# EasyEDA Pro project 导入eda专业版即可.epro

# Schematic 电路管理_2
Create Date: 2024-08-25; Page Name: P1; Project Name: 2.4g发送端电路图; Schematic Name: 睫毛哥电路管理_2; Update Date: 2024-08-25; Company: 嘉立创EDA; Page Size: A4; Version: V1.0
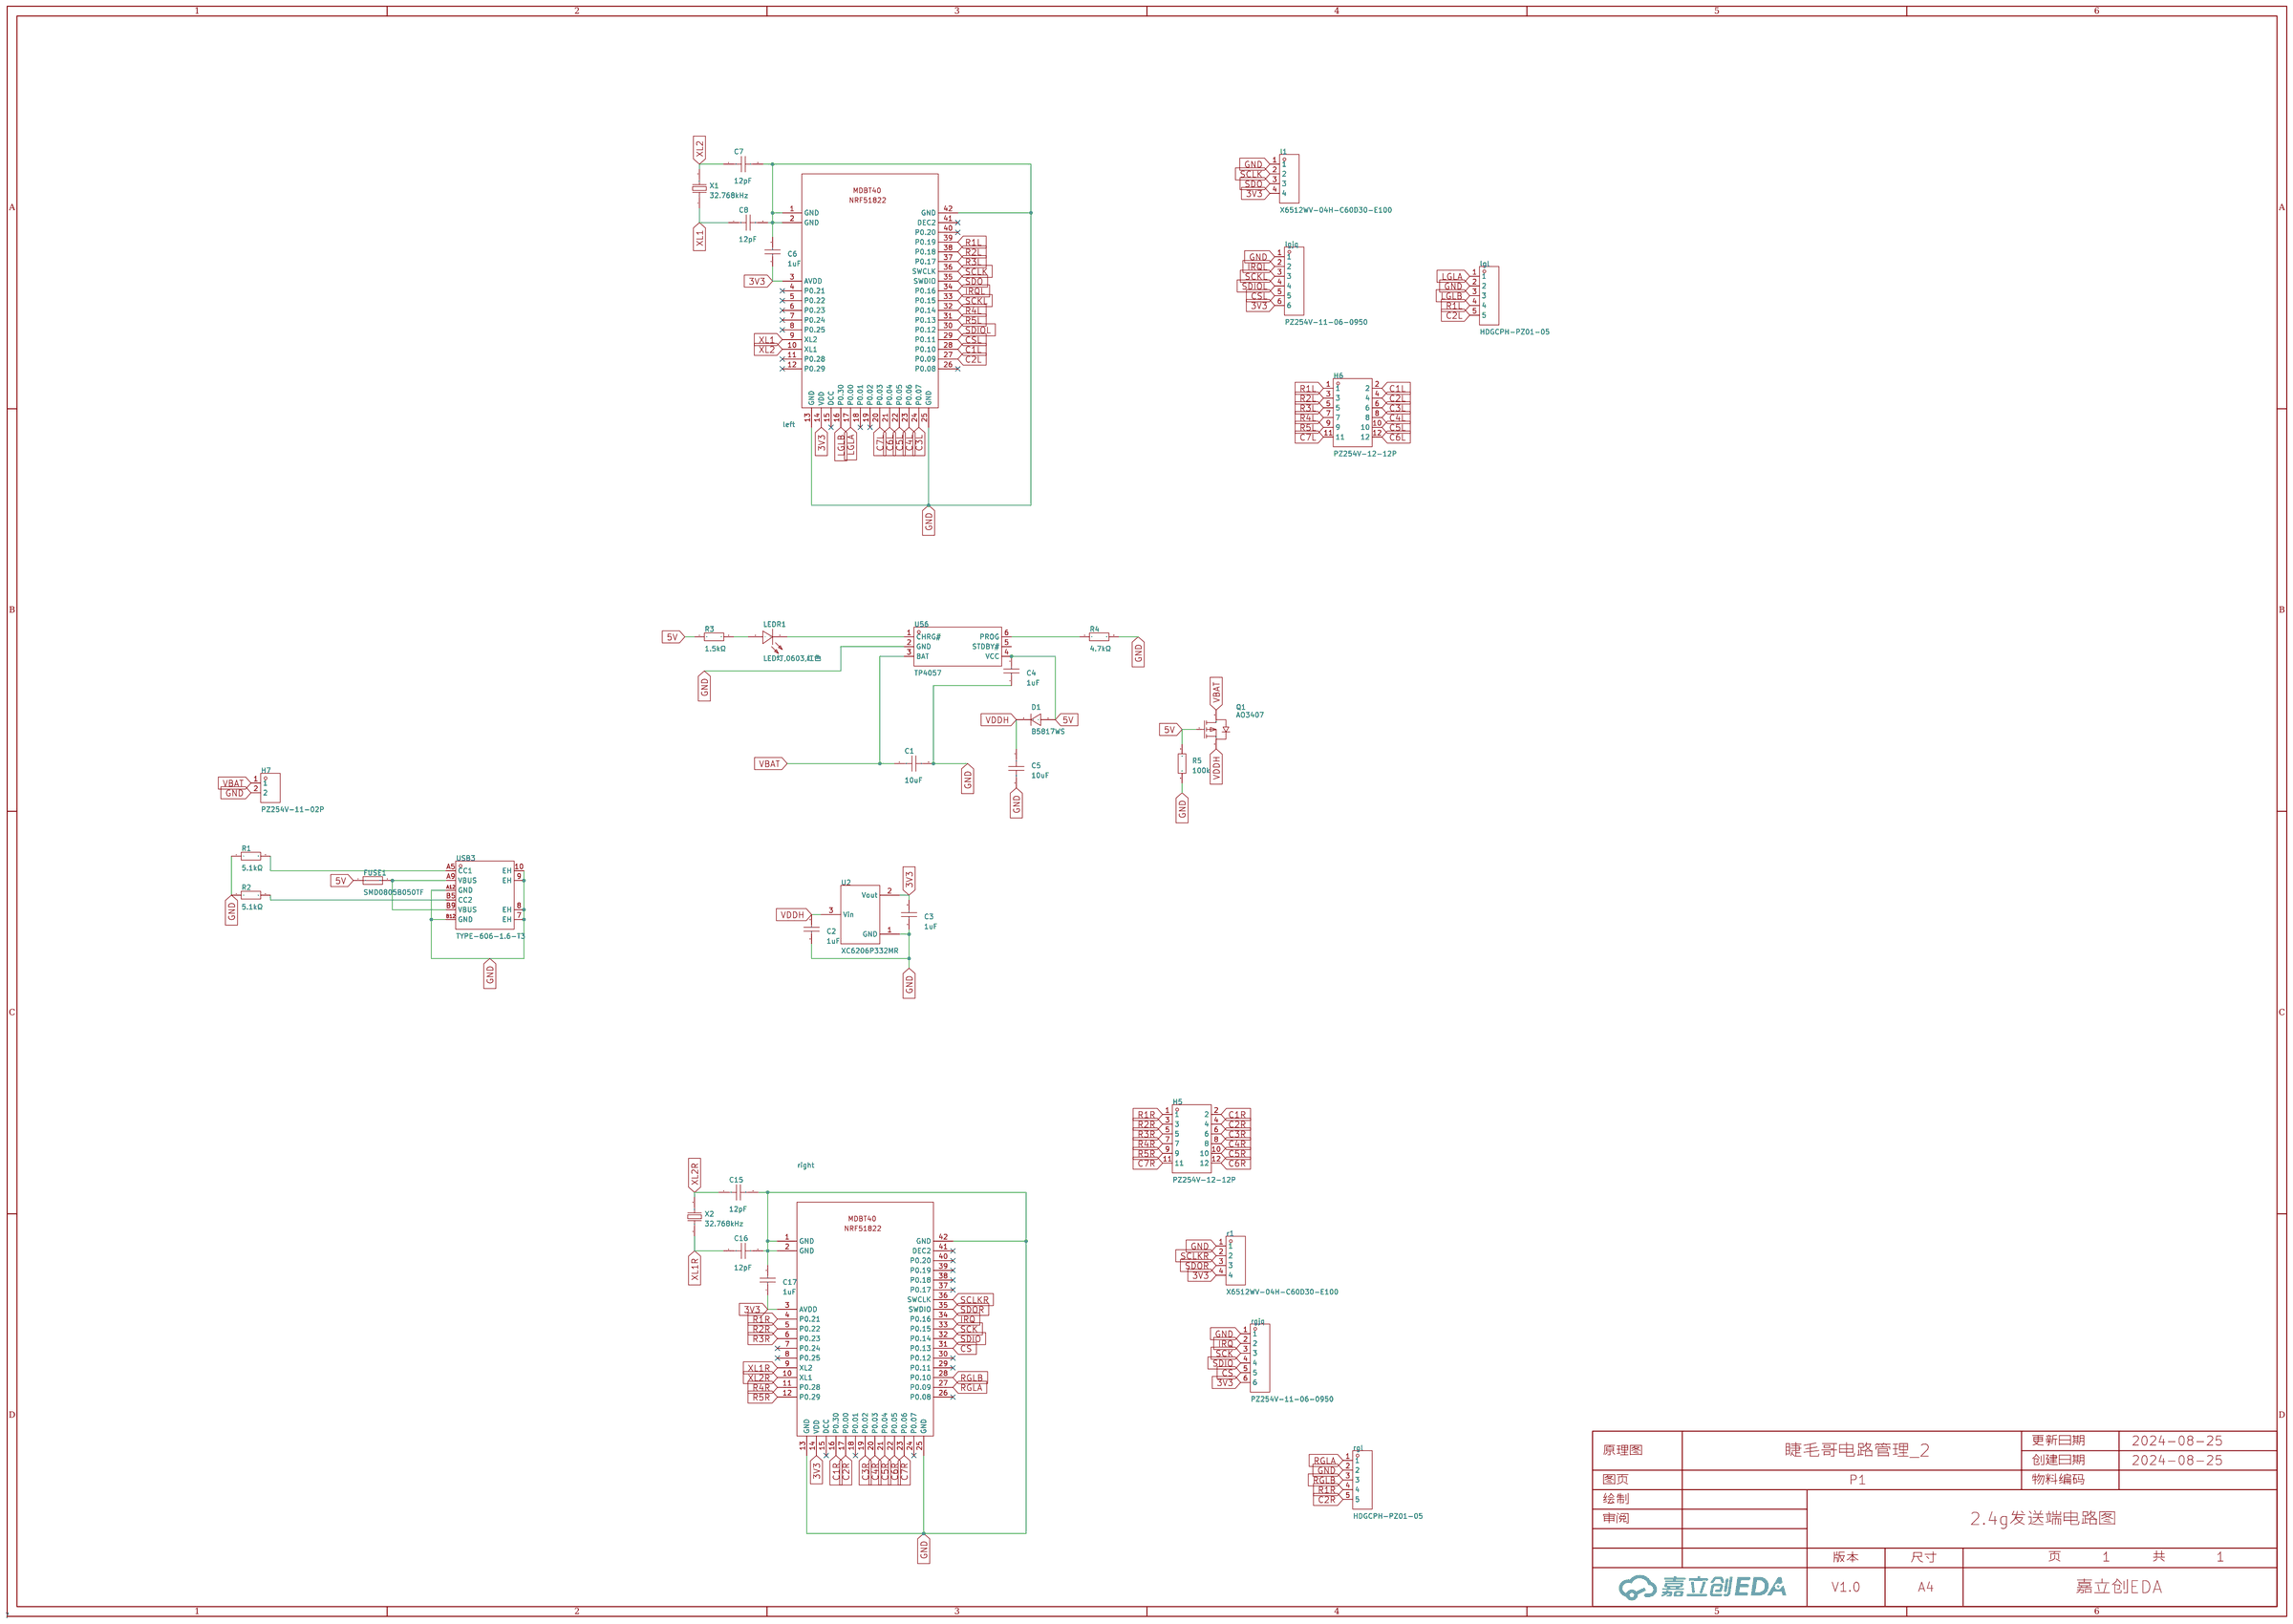
[diagram p0: schematic sheet]

## Parts
C1  10uF  [C0603]
C2  1uF  [C0603]
C3  1uF  [C0603]
C4  1uF  [C0603]
C5  10uF  [C0603]
C6  1uF  [C0603]
C7  12pF  [C0603]
C8  12pF  [C0603]
C15  12pF  [C0603]
C16  12pF  [C0603]
C17  1uF  [C0603]
D1  B5817WS  [SOD-323_L1.7-W1.3-LS2.7-FD]
FUSE1  SMD0805B050TF  [F0805]
H5  PZ254V-12-12P  [HDR-TH_12P-P2.54-V-M-R2-C6-S2.54]
H6  PZ254V-12-12P  [HDR-TH_12P-P2.54-V-M-R2-C6-S2.54]
H7  PZ254V-11-02P  [HDR-TH_2P-P2.54-V-M]
l1  X6512WV-04H-C60D30-E100  [HDR-TH_4P-P2.54-V-M-1]
LEDR1  LED灯,0603,红色  [LED0603-RD_RED]
left  -  [MDBT40]
lgjq  PZ254V-11-06-0950  [HDR-TH_6P-P2.54-V-M-1]
lgl  HDGCPH-PZ01-05  [HDR-TH_5P-P2.54-V-M-1]
Q1  AO3407  [SOT-23-3_L2.9-W1.6-P1.90-LS2.8-BR]
R1  5.1kΩ  [R0603]
r1  X6512WV-04H-C60D30-E100  [HDR-TH_4P-P2.54-V-M-1]
R2  5.1kΩ  [R0603]
R3  1.5kΩ  [R0603]
R4  4.7kΩ  [R0603]
R5  100k  [R0603]
rgjq  PZ254V-11-06-0950  [HDR-TH_6P-P2.54-V-M-1]
rgl  HDGCPH-PZ01-05  [HDR-TH_5P-P2.54-V-M-1]
right  -  [MDBT40]
U2  XC6206P332MR  [SOT-23-3_L2.9-W1.6-P1.90-LS2.8-BR]
U56  TP4057  [SOT-23-6_L2.9-W1.6-P0.95-LS2.8-BR]
USB3  TYPE-606-1.6-T3  [USB-C-SMD_TYPE-606-1.6-T3]
X1  32.768kHz  [FC-135R_L3.2-W1.5]
X2  32.768kHz  [FC-135R_L3.2-W1.5]

## Library data of the parts
C1 C5 = CL10A106KP8NNNC: 容值:10uF;精度:±10%;额定电压:10V;材质(温度系数):X5R;; LCSC Part Name: 10uF ±10% 10V; Supplier Part: C19702; Manufacturer: SAMSUNG(三星); Supplier Footprint: 0603; Datasheet: https://atta.szlcsc.com/upload/public/pdf/source/20160218/1457707763339.pdf; Supplier: LCSC; Tolerance: ±10%; Voltage Rated: 10V; Temperature Coefficient: X5R
C2-C4 C6 C17 = CL10A105KB8NNNC: 容值:1uF;精度:±10%;额定电压:50V;材质(温度系数):X5R;; LCSC Part Name: 1uF ±10% 50V; Supplier Part: C15849; Manufacturer: SAMSUNG(三星); Supplier Footprint: 0603; JLCPCB Part Class: 基础库; Datasheet: https://atta.szlcsc.com/upload/public/pdf/source/20160103/1457707679084.pdf; Supplier: LCSC; Tolerance: ±10%; Voltage Rated: 50V; Temperature Coefficient: X5R
C7 C8 C15 C16 = 0603Y0160120KFR: 容值:12pF;精度:±10%;额定电压:16V;材质(温度系数):-;; LCSC Part Name: 12pF ±10% 16V; Supplier Part: C2313740; Manufacturer: Knowles(楼氏); Supplier Footprint: 0603; JLCPCB Part Class: 扩展库; Supplier: LCSC; Tolerance: ±10%; Voltage Rated: 16V
D1 = B5817WS: 正向压降(Vf):750mV@3A;直流反向耐压(Vr):20V;平均整流电流(Io):1A;; LCSC Part Name: 电压:20V 电流:1A; Supplier Part: C511871; Manufacturer: BORN(伯恩半导体); Supplier Footprint: SOD-323; JLCPCB Part Class: 扩展库; Datasheet: https://atta.szlcsc.com/upload/public/pdf/source/20200413/C511871_84C991E4F87F9BC6B00A967897FF2061.pdf; Supplier: LCSC; Forward Voltage (Vf@If): 750mV@3A; Reverse Voltage (Vr): 20V; Average Rectified Current (Io): 1A
FUSE1 = SMD0805B050TF: 最大电压:6V;最大电流:100A;保持电流:500mA;跳闸电流:1A;; LCSC Part Name: 6V 500mA 0805自恢复; Supplier Part: C269104; Manufacturer: Brightking(君耀电子); Supplier Footprint: 0805; Datasheet: https://atta.szlcsc.com/upload/public/pdf/source/20180814/C269104_466839A5DB65F6E723CA6A162ACE747B.pdf; Supplier: LCSC; Operating Voltage (Max): 6V; Current Rating (Max): 100A; Hold Current: 500mA; Trip Current: 1A; Maximum Time to Trip: 100ms
H5 H6 = PZ254V-12-12P: 插针结构:2x6P;间距:2.54mm;行距:2.54mm;圆针/方针:方针;安装类型:直插;排数:双排;总PIN位数:12P;额定电流:-;额定电压:-;配合针长度:6mm;塑高:2.5mm;端接针长度:3mm;触头材质:黄铜;触头镀层:-;工作温度范围:-40℃~+105℃;颜色:黑色;; LCSC Part Name: 间距:2.54mm 2x6P 直插 方针; Supplier Part: C492423; Manufacturer: XFCN(兴飞); Supplier Footprint: 插件,P=2.54mm; Datasheet: https://atta.szlcsc.com/upload/public/pdf/source/20200309/C492423_E4E2C9BC0EB9D59A2ABE4377D2E234B2.pdf; Supplier: LCSC; Pin Structure: 2x6P; Pitch: 2.54mm; Row Spacing: 2.54mm; Circluar Pins/Square Pins: 方针; Mounting Type: 直插; Number of Rows: 双排; Number of Pins: 12P; Length of Mating Pin: 6mm; Insulation Height: 2.5mm; Length of End Connection Pin: 3mm; Contact Material: 黄铜; Operating Temperature Range: -40℃~+105℃; Color: 黑色
H7 = PZ254V-11-02P: 插针结构:1x2P;间距:2.54mm;行距:-;圆针/方针:方针;安装类型:直插;排数:单排;总PIN位数:2P;额定电流:-;额定电压:-;配合针长度:6mm;塑高:2.5mm;端接针长度:3mm;触头材质:黄铜;触头镀层:-;工作温度范围:-40℃~+105℃;颜色:黑色;; LCSC Part Name: 间距:2.54mm 1x2P 直插 方针; Supplier Part: C492401; Manufacturer: XFCN(兴飞); Supplier Footprint: 插件,P=2.54mm; Datasheet: https://atta.szlcsc.com/upload/public/pdf/source/20200309/C492401_A812433581A9B211A7FFA413ADDFF0E5.pdf; Supplier: LCSC; Pin Structure: 1x2P; Pitch: 2.54mm; Circluar Pins/Square Pins: 方针; Mounting Type: 直插; Number of Rows: 单排; Number of Pins: 2P; Length of Mating Pin: 6mm; Insulation Height: 2.5mm; Length of End Connection Pin: 3mm; Contact Material: 黄铜; Operating Temperature Range: -40℃~+105℃; Color: 黑色
l1 r1 = X6512WV-04H-C60D30-E100: 插针结构:1x4P;间距:2.54mm;行距:2.54mm;圆针/方针:方针;安装类型:-;排数:单排;总PIN位数:4P;额定电流:3A;额定电压:250V;配合针长度:6mm;塑高:2.5mm;端接针长度:3mm;触头材质:黄铜;触头镀层:金;工作温度范围:-40℃~+105℃;焊接温度(最大值):260℃;颜色:黑色;; LCSC Part Name: 1x4P 间距:2.54mm 方针; Supplier Part: C5242237; Manufacturer: XKB Connection(中国星坤); Supplier Footprint: 插件,P=2.54mm; Datasheet: https://atta.szlcsc.com/upload/public/pdf/source/20221103/F875B4EAB1B7CCE28A1CCAF56DA9899E.pdf; Supplier: LCSC; Pin Structure: 1x4P; Pitch: 2.54mm; Row Spacing: 2.54mm; Circluar Pins/Square Pins: 方针; Number of Rows: 单排; Number of Pins: 4P; Current Rating (Max): 3A; Voltage Rating (Max): 250V; Length of Mating Pin: 6mm; Insulation Height: 2.5mm; Length of End Connection Pin: 3mm; Contact Material: 黄铜; Contact Plating: 金; Operating Temperature Range: -40℃~+105℃; Soldering Temperature(Max): 260℃; Color: 黑色
LEDR1 = LED灯,0603,红色: Supplier Part: C9900011153; Supplier Footprint: 0603-LED红灯; JLCPCB Part Class: 扩展库; Datasheet: https://atta.szlcsc.comnull; Supplier: LCSC
left right = MDBT40
lgjq rgjq = PZ254V-11-06-0950: LCSC Part Name: 排针 间距2.54mm 1X6P 单排 直插 直针外露4mm; Supplier Part: C962330; Manufacturer: XFCN(兴飞); Supplier Footprint: 插件,P=2.54mm; Supplier: LCSC
lgl rgl = HDGCPH-PZ01-05: LCSC Part Name: 2.54单排针直插排针L11.6/3.0 1x5P; Supplier Part: C19190971; Manufacturer: HDGC(华德共创); Supplier Footprint: 插件,P=2.54mm; Datasheet: https://atta.szlcsc.com/upload/public/pdf/source/20231110/9EB16C2E1D607182756B4718BDE6A9C4.pdf; Supplier: LCSC
Q1 = AO3407: 类型:-;漏源电压(Vdss):-;连续漏极电流(Id):-;功率(Pd):-;导通电阻(RDS(on)@Vgs,Id):-;阈值电压(Vgs(th)@Id):-;; Supplier Part: C727158; Manufacturer: TWGMC(台湾迪嘉); Supplier Footprint: SOT-23; JLCPCB Part Class: 扩展库; Datasheet: https://atta.szlcsc.com/upload/public/pdf/source/20200827/C727158_282ADD6E8EE14B419EAB19F2812EAF45.pdf; Supplier: LCSC
R1 R2 = 0603WAF5101T5E: 电阻类型:厚膜电阻;阻值:5.1kΩ;精度:±1%;功率:100mW;; LCSC Part Name: 5.1kΩ ±1% 100mW; Supplier Part: C23186; Manufacturer: UNI-ROYAL(厚声); Supplier Footprint: 0603; JLCPCB Part Class: 基础库; Datasheet: https://atta.szlcsc.com/upload/public/pdf/source/20200306/C422600_1E6D84923E4A46A82E41ADD87F860B5C.pdf; Supplier: LCSC; Type: 厚膜电阻; Tolerance: ±1%; Power(Watts): 100mW; Temperature Coefficient: ±100ppm/℃; Overload Voltage (Max): 75V; Operating Temperature Range: -55℃~+155℃
R3 R5 = RS-03K102JT: 电阻类型:厚膜电阻;阻值:1kΩ;精度:±5%;功率:100mW;最大工作电压:50V;温度系数:±100ppm/℃;; LCSC Part Name: 1kΩ ±5% 100mW; Supplier Part: C73797; Manufacturer: FH(风华); Supplier Footprint: 0603; Datasheet: https://atta.szlcsc.com/upload/public/pdf/source/20140616/1457707091974.pdf; Supplier: LCSC; Type: 厚膜电阻; Tolerance: ±5%; Power(Watts): 100mW; Overload Voltage (Max): 50V; Temperature Coefficient: ±100ppm/℃; Operating Temperature Range: -55℃~+155℃
R4 = 0603WAF4701T5E: 阻值:4.7kΩ;精度:±1%;功率:100mW;温度系数:±100ppm/℃;电阻类型:厚膜电阻;; LCSC Part Name: 4.7kΩ ±1% 100mW 厚膜电阻; Supplier Part: C23162; Manufacturer: UNI-ROYAL(厚声); Supplier Footprint: 0603; Datasheet: https://atta.szlcsc.com/upload/public/pdf/source/20200306/C422600_1E6D84923E4A46A82E41ADD87F860B5C.pdf; Supplier: LCSC; Tolerance: ±1%; Power(Watts): 100mW; Overload Voltage (Max): 75V; Temperature Coefficient: ±100ppm/℃; Type: 厚膜电阻; Operating Temperature Range: -55℃~+155℃
U2 = XC6206P332MR_C5446: 输出类型:固定;输出极性:正;最大输入电压:6V;输出电压:3.3V;输出电流:200mA;电源纹波抑制比(PSRR):-;; Supplier Part: C5446; Manufacturer: TOREX(特瑞仕); Supplier Footprint: SOT-23-3L; JLCPCB Part Class: 基础库; Datasheet: https://atta.szlcsc.com/upload/public/pdf/source/20130801/1457706628791.pdf; Supplier: LCSC; Output Type: 固定; Output Polarity: 正; Number of Outputs: 1; Maximum Input Voltage: 6V; Output Voltage: 3.3V; Dropout Voltage: 680mV@(100mA); Output Current: 200mA
U56 = TP4057: 电源电压:6.5V;最大充电电流:500mA;电池类型:锂离子/聚合物;电池节数:1;; Supplier Part: C725791; Manufacturer: UMW(友台半导体); Supplier Footprint: SOT-23-6; Datasheet: https://atta.szlcsc.com/upload/public/pdf/source/20231109/7FB39B0490CD1514A6792371FCA0BB30.pdf; Supplier: LCSC; Supply Voltage: 6.5V; Maximum Charge Current: 500mA; Type of Battery: 锂离子/聚合物; Number of Cells: 1; Operating Temperature: -40℃~+85℃
USB3 = TYPE-606-1.6-T3: 连接器类型:Type-C;标准:-;公母:母;触点数量:6P;端口数量:1;安装方式:沉板;额定电流 - 电源:3A;工作温度范围:-25℃~+85℃;; LCSC Part Name: Type-C 母 沉板 沉板式1.6mm四脚母座端子镀金; Supplier Part: C2689842; Manufacturer: Yuandi(元迪); Supplier Footprint: SMD; Datasheet: https://atta.szlcsc.com/upload/public/pdf/source/20210201/C2689842_AEB1C5B3172DCF256BD26506C0F3DE02.pdf; Supplier: LCSC; Connector Type: Type-C; Gender: 母; Number of Contacts: 6P; Number of Ports: 1; Mounting Style: 沉板; Current Rating - Power (Max): 3A; Operating Temperature Range: -25℃~+85℃
X1 X2 = Q13FC1350000400: 频率:32.768kHz;频率公差:±20ppm;负载电容:12.5pF;; LCSC Part Name: 32.768kHz ±20ppm 12.5pF; Supplier Part: C32346; Manufacturer: EPSON(爱普生); Supplier Footprint: SMD3215-2P; JLCPCB Part Class: 基础库; Datasheet: https://atta.szlcsc.com/upload/public/pdf/source/20190108/C32346_746D6B07EAF90824457A96480007685F.pdf; Supplier: LCSC; Crystal Type: 贴片无源晶振; Frequency Tolerance: ±20ppm; Load Capacitance: 12.5pF; Equivalent Series Resistance (ESR): 70kΩ; Operating Temperature: -40℃~+85℃

## Nets
3V3: C3.2 C6.1 C17.1 l1.4 left.3(AVDD) left.14(VDD) lgjq.6 r1.4 rgjq.6 right.3(AVDD) right.14(VDD) U2.2(Vout)
5V: C4.2 D1.1(A) FUSE1.1 Q1.1(G) R3.1 R5.1 U56.4(VCC)
GND: C1.2 C2.1 C3.1 C4.1 C5.2 C6.2 C7.2 C8.2 C15.2 C16.2 C17.2 H7.2 l1.1 left.1(GND) left.2(GND) left.13(GND) left.25(GND) left.42(GND) lgjq.1 lgl.2 R1.1 r1.1 R2.1 R4.2 R5.2 rgjq.1 rgl.2 right.1(GND) right.2(GND) right.13(GND) right.25(GND) right.42(GND) U2.1(GND) U56.2(GND) USB3.7(EH) USB3.8(EH) USB3.9(EH) USB3.10(EH) USB3.A12(GND) USB3.B12(GND)
VBAT: C1.1 H7.1 Q1.3(D) U56.3(BAT)
VDDH: C2.2 C5.1 D1.2(K) Q1.2(S) U2.3(Vin)
C1L: H6.2 left.28(P0.10)
C1R: H5.2 right.16(P0.30)
C2L: H6.4 left.27(P0.09) lgl.5
C2R: H5.4 rgl.5 right.17(P0.00)
C3L: H6.6 left.24(P0.07)
C3R: H5.6 right.19(P0.02)
C4L: H6.8 left.23(P0.06)
C4R: H5.8 right.20(P0.03)
C5L: H6.10 left.22(P0.05)
C5R: H5.10 right.21(P0.04)
C6L: H6.12 left.21(P0.04)
C6R: H5.12 right.22(P0.05)
C7L: H6.11 left.20(P0.03)
C7R: H5.11 right.23(P0.06)
CS: rgjq.5 right.31(P0.13)
CSL: left.29(P0.11) lgjq.5
IRQ: rgjq.2 right.34(P0.16)
IRQL: left.34(P0.16) lgjq.2
LGLA: left.17(P0.00) lgl.1
LGLB: left.16(P0.30) lgl.3
R1L: H6.1 left.39(P0.19) lgl.4
R1R: H5.1 rgl.4 right.4(P0.21)
R2L: H6.3 left.38(P0.18)
R2R: H5.3 right.5(P0.22)
R3L: H6.5 left.37(P0.17)
R3R: H5.5 right.6(P0.23)
R4L: H6.7 left.32(P0.14)
R4R: H5.7 right.11(P0.28)
R5L: H6.9 left.31(P0.13)
R5R: H5.9 right.12(P0.29)
RGLA: rgl.1 right.27(P0.09)
RGLB: rgl.3 right.28(P0.10)
SCK: rgjq.3 right.33(P0.15)
SCKL: left.33(P0.15) lgjq.3
SCLK: l1.2 left.36(SWCLK)
SCLKR: r1.2 right.36(SWCLK)
SDIO: rgjq.4 right.32(P0.14)
SDIOL: left.30(P0.12) lgjq.4
SDO: l1.3 left.35(SWDIO)
SDOR: r1.3 right.35(SWDIO)
XL1: C8.1 left.9(XL2) X1.1
XL1R: C16.1 right.9(XL2) X2.1
XL2: C7.1 left.10(XL1) X1.2
XL2R: C15.1 right.10(XL1) X2.2
$1N432: LEDR1.1(-) U56.1(CHRG#)
$1N434: R4.1 U56.6(PROG)
$1N892: LEDR1.2(+) R3.2
$1N3578: FUSE1.2 USB3.A9(VBUS) USB3.B9(VBUS)
$1N3579: R1.2 USB3.A5(CC1)
$1N3580: R2.2 USB3.B5(CC2)

Not connected (* = marked no-connect by the designer): left 4(P0.21)* 5(P0.22)* 6(P0.23)* 7(P0.24)* 8(P0.25)* 11(P0.28)* 12(P0.29)* 15(DCC)* 18(P0.01)* 19(P0.02)* 26(P0.08)* 40(P0.20)* 41(DEC2)*; right 7(P0.24)* 8(P0.25)* 15(DCC)* 18(P0.01)* 24(P0.07)* 26(P0.08)* 29(P0.11)* 30(P0.12)* 37(P0.17)* 38(P0.18)* 39(P0.19)* 40(P0.20)* 41(DEC2)*; U56 5(STDBY#)

# Board PCB11_2
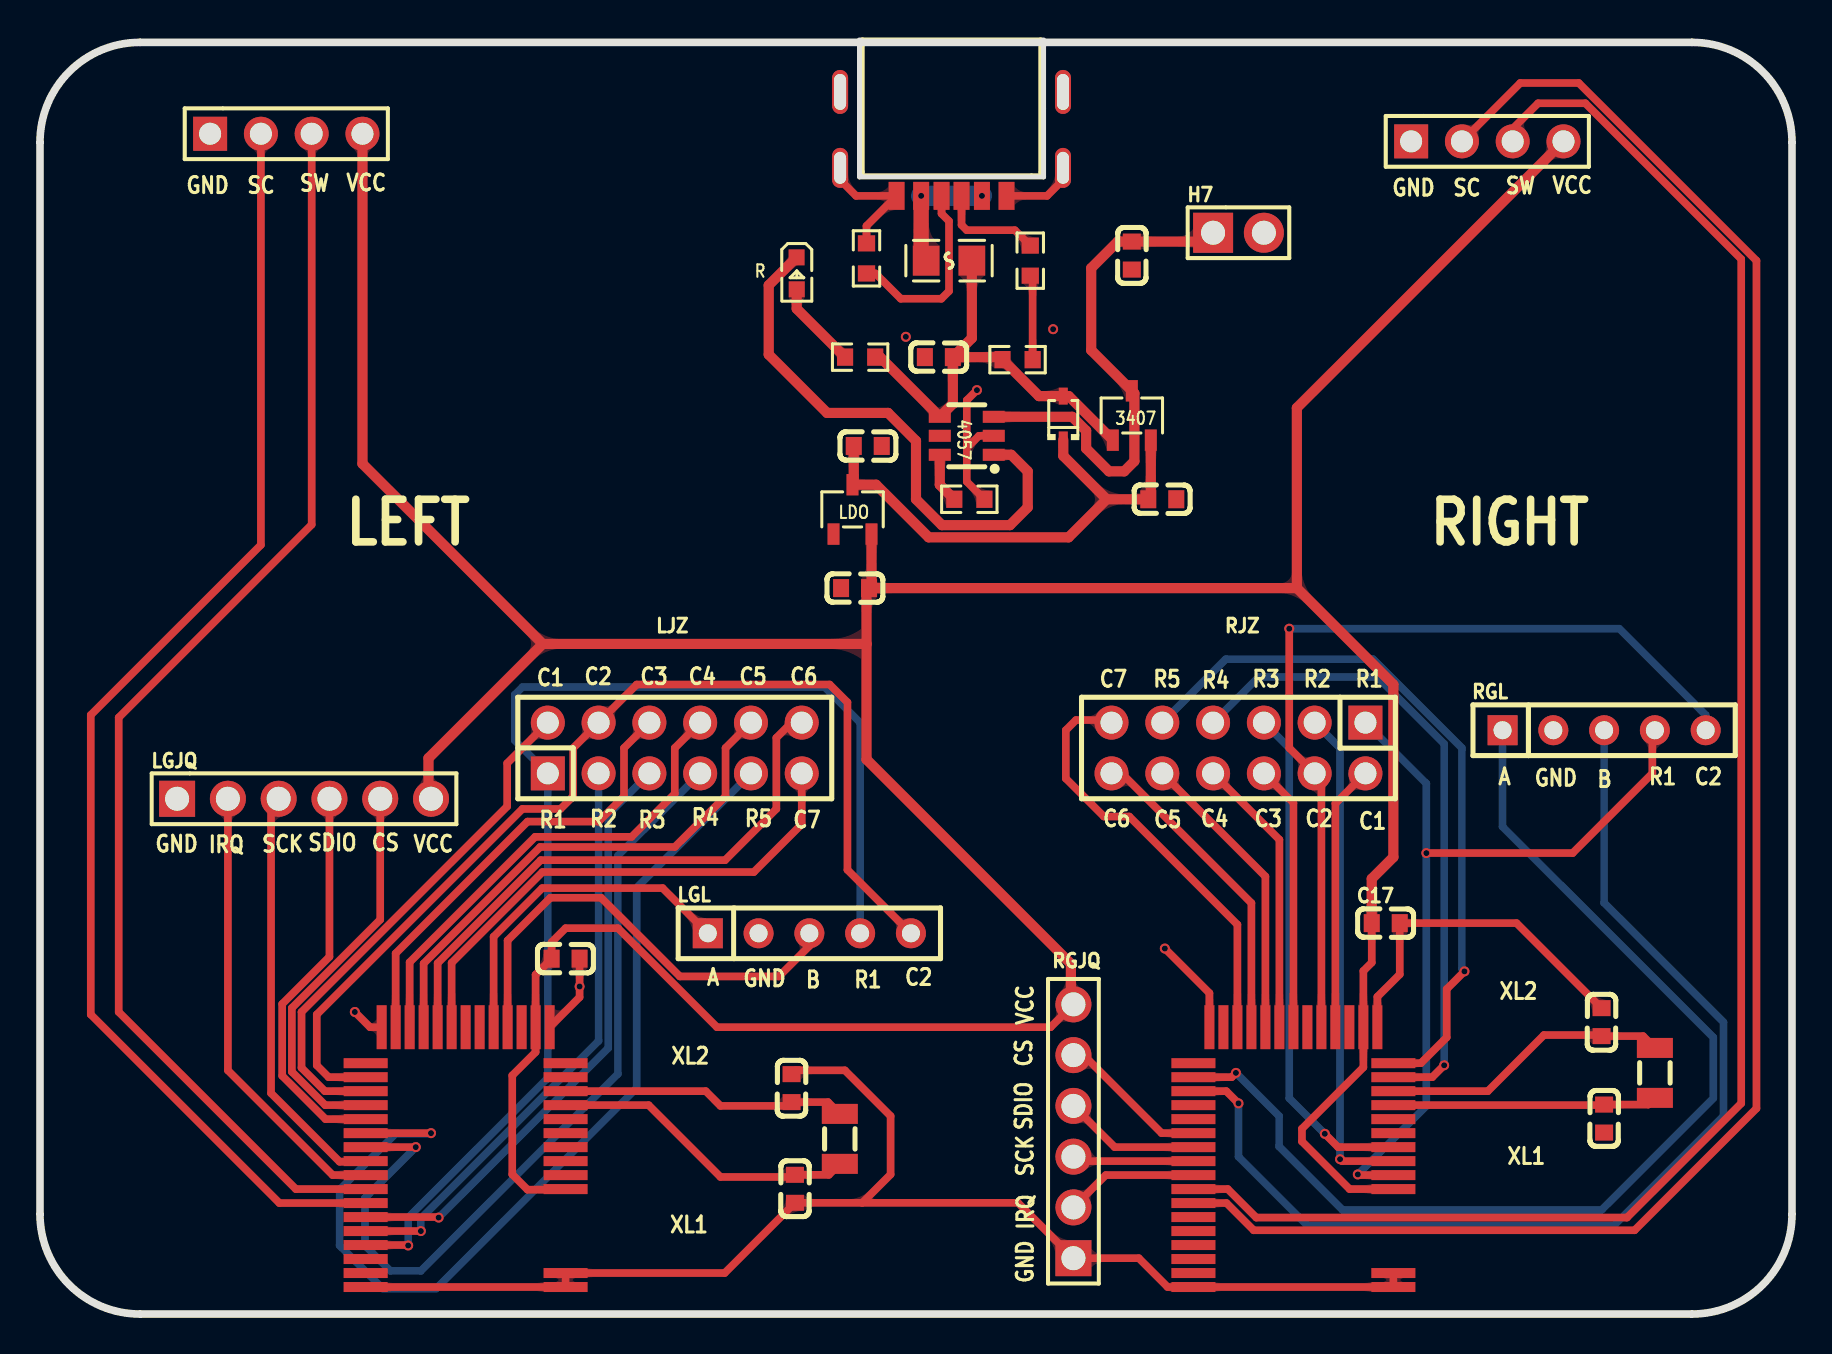
[diagram p1: board, top side]
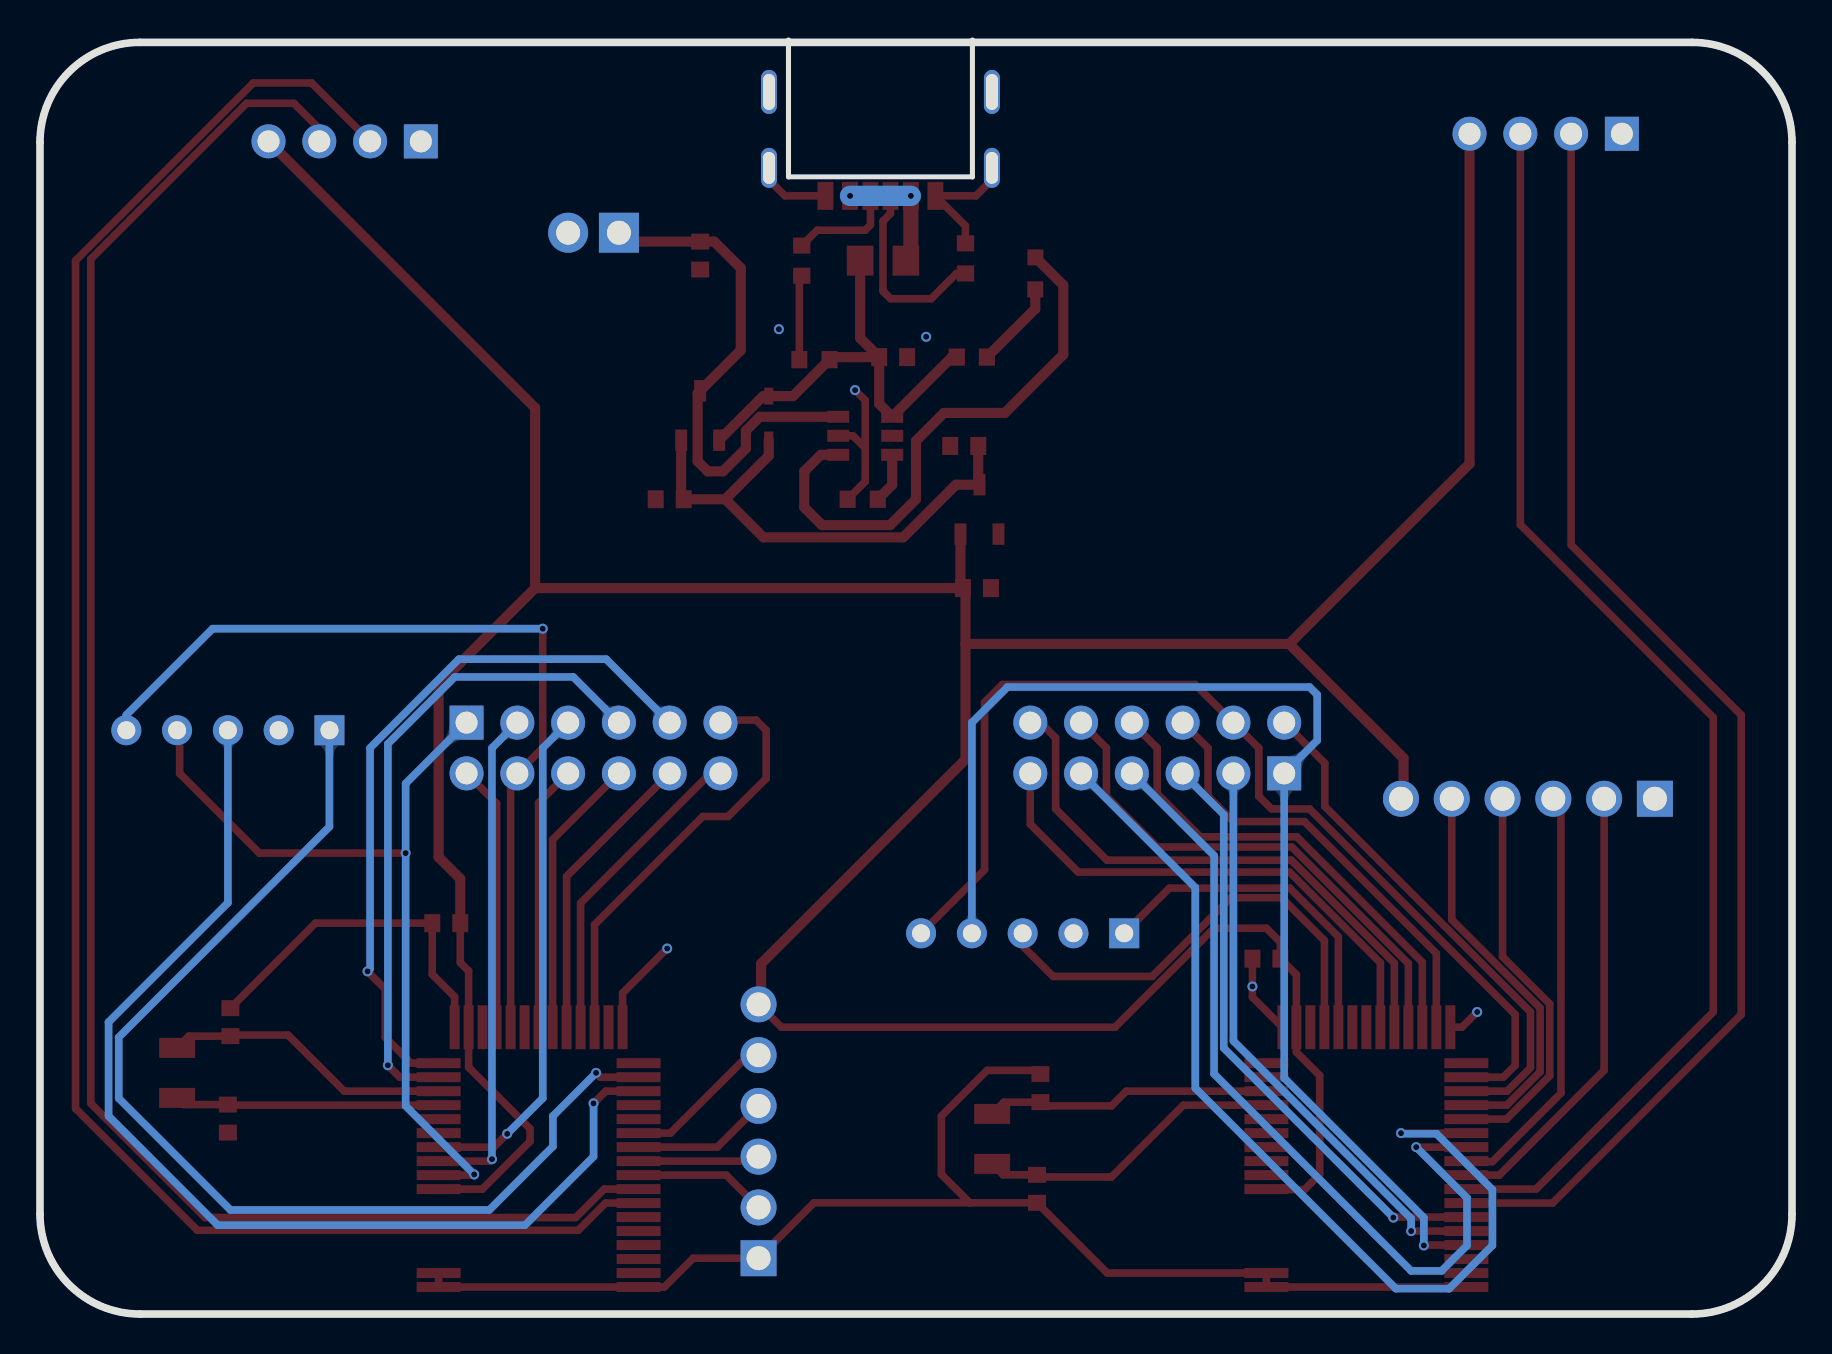
[diagram p2: board, bottom side, seen from below]

Outline 87.63 x 63.75 mm; copper layers: Top Layer, Bottom Layer. Coordinates in mm from the lower left corner of the outline.
Outline path: 0,58.63 0,5 arc(1.46,1.46) 5,0 82.63,0 arc(86.17,1.46) 87.63,5 87.63,58.63 arc(86.17,62.16) 82.63,63.63 5,63.63 arc(1.46,62.16) 0,58.63
Stack: Top Layer 0.035mm / Dielectric1 1.51mm FR4 er 4.5 / Bottom Layer 0.035mm

## Design rules (mm)
template: JLCPCB Capability(Two Layers Board)
spacing copperThickness1oz (default): track to track 0.102, other pairs 0.152 to 0.3
spacing copperThickness2oz: track to track 0.203, other pairs 0.152 to 0.3
track width copperThickness1oz (default): min 0.127, default 0.254, max 2.54
track width copperThickness2oz: min 0.203, default 0.254, max 2.54
differential pair differentialPair (default): width min 0.127, default 0.254, max 2.54; gap min 0.152, default 0.152
via viaSize (default): diameter min 0.5, default 0.61, max 10; hole min 0.3, default 0.305, max 6.3

## Placement (name value [footprint] x y rotation side)
C1  10uF  [C0603]  54.61 52.96 270 top
C2  1uF  [C0603]  41.4 43.43 180 top
C3  1uF  [C0603]  40.77 36.32 0 top
C4  1uF  [C0603]  44.96 47.88 0 top
C5  10uF  [C0603]  56.13 40.77 0 top
C6  1uF  [C0603]  26.29 17.78 0 top
C7  12pF  [C0603]  37.59 11.3 90 top
C8  12pF  [C0603]  37.76 6.26 270 top
C15  12pF  [C0603]  78.11 14.61 90 top
C16  12pF  [C0603]  78.23 9.78 270 top
C17  1uF  [C0603]  67.31 19.56 0 top
D1  B5817WS  [SOD-323_L1.7-W1.3-LS2.7-FD]  51.18 44.83 270 top
FUSE1  SMD0805B050TF  [F0805]  45.47 52.71 180 top
H7  PZ254V-11-02P  [HDR-TH_2P-P2.54-V-M]  59.94 54.1 0 top
l1  X6512WV-04H-C60D30-E100  [HDR-TH_4P-P2.54-V-M-1]  12.32 59.06 0 top
LEDR1  LED灯,0603,红色  [LED0603-RD_RED]  37.85 52.07 270 top
left  -  [MDBT40]  26.29 14.35 180 top
LGJQ  PZ254V-11-06-0950  [HDR-TH_6P-P2.54-V-M-1]  13.21 25.78 0 top
LGL  HDGCPH-PZ01-05  [HDR-TH_5P-P2.54-V-M-1]  38.48 19.05 0 top
LJZ  PZ254V-12-12P  [HDR-TH_12P-P2.54-V-M-R2-C6-S2.54]  31.75 28.32 0 top
Q1  AO3407  [SOT-23-3_L2.9-W1.6-P1.90-LS2.8-BR]  54.61 44.96 270 top
r1  X6512WV-04H-C60D30-E100  [HDR-TH_4P-P2.54-V-M-1]  72.39 58.67 0 top
R1  5.1kΩ  [R0603]  49.53 52.71 90 top
R2  5.1kΩ  [R0603]  41.34 52.82 270 top
R3  1.5kΩ  [R0603]  41.02 47.88 180 top
R4  4.7kΩ  [R0603]  46.48 40.77 0 top
R5  100k  [R0603]  48.9 47.75 0 top
RGJQ  PZ254V-11-06-0950  [HDR-TH_6P-P2.54-V-M-1]  51.69 9.14 90 top
RGL  HDGCPH-PZ01-05  [HDR-TH_5P-P2.54-V-M-1]  78.23 29.21 0 top
right  -  [MDBT40]  67.69 14.35 180 top
RJZ  PZ254V-12-12P  [HDR-TH_12P-P2.54-V-M-R2-C6-S2.54]  59.94 28.32 180 top
U2  XC6206P332MR  [SOT-23-3_L2.9-W1.6-P1.90-LS2.8-BR]  40.64 40.26 270 top
U56  TP4057  [SOT-23-6_L2.9-W1.6-P0.95-LS2.8-BR]  46.36 43.94 0 top
USB3  TYPE-606-1.6-T3  [USB-C-SMD_TYPE-606-1.6-T3]  45.59 58.55 180 top
X1  32.768kHz  [FC-135R_L3.2-W1.5]  40 8.76 90 top
X2  32.768kHz  [FC-135R_L3.2-W1.5]  80.77 12.07 90 top

## Footprints (pads in the part's own frame, mm; a bottom-side part is the same pattern mirrored in y, then rotated)
C0603
  rect 0.8x0.9 smd: 1(-0.7,0) 2(0.7,0)
F0805
  rect 1.335x1.5 smd: 1(-1.143,0) 2(1.143,0)
FC-135R_L3.2-W1.5
  rect 1x1.8 smd: 1(-1.25,0) 2(1.25,0)
HDR-TH_2P-P2.54-V-M
  rect 2x2 hole 1.2: 1(-1.27,0)
  round 2 hole 1.2: 2(1.27,0)
HDR-TH_4P-P2.54-V-M-1
  rect 1.7x1.7 hole 1.1: 1(-3.81,0)
  round 1.7 hole 1.1: 2(-1.27,0) 3(1.27,0) 4(3.81,0)
HDR-TH_5P-P2.54-V-M-1
  rect 1.5x1.5 hole 0.9: 1(-5.08,0)
  round 1.5 hole 0.9: 2(-2.54,0) 3(0,0) 4(2.54,0) 5(5.08,0)
HDR-TH_6P-P2.54-V-M-1
  rect 1.8x1.8 hole 1.2: 1(-6.35,0)
  round 1.8 hole 1.2: 2(-3.81,0) 3(-1.27,0) 4(1.27,0) 5(3.81,0) 6(6.35,0)
HDR-TH_12P-P2.54-V-M-R2-C6-S2.54
  rect 1.7x1.7 hole 1.1: 1(-6.35,-1.27)
  round 1.7 hole 1.1: 2(-6.35,1.27) 3(-3.81,-1.27) 4(-3.81,1.27) 5(-1.27,-1.27) 6(-1.27,1.27) 7(1.27,-1.27) 8(1.27,1.27) 9(3.81,-1.27) 10(3.81,1.27) 11(6.35,-1.27) 12(6.35,1.27)
LED0603-RD_RED
  rect 0.8x0.8 smd: 1(-0.799,-0.004) 2(0.799,0.004)
MDBT40
  rect 2.2x0.5 smd: 1(0,13) 2(0,12.3) 3(0,8.1) 4(0,7.4) 5(0,6.7) 6(0,6) 7(0,5.3) 8(0,4.6) 9(0,3.9) 10(0,3.2) 11(0,2.5) 12(0,1.8) 26(10,1.8) 27(10,2.5) 28(10,3.2) 29(10,3.9) 30(10,4.6) 31(10,5.3) 32(10,6) 33(10,6.7) 34(10,7.4) 35(10,8.1) 36(10,8.8) 37(10,9.5) 38(10,10.2) 39(10,10.9) 40(10,11.6) 41(10,12.3) 42(10,13)
  rect 0.5x2.2 smd: 13(0.8,0) 14(1.5,0) 15(2.2,0) 16(2.9,0) 17(3.6,0) 18(4.3,0) 19(5,0) 20(5.7,0) 21(6.4,0) 22(7.1,0) 23(7.8,0) 24(8.5,0) 25(9.2,0)
R0603
  rect 0.806x0.864 smd: 1(-0.753,0) 2(0.753,0)
SOD-323_L1.7-W1.3-LS2.7-FD
  rect 0.845x0.455 smd: 1(-1.097,0) 2(1.097,0)
SOT-23-3_L2.9-W1.6-P1.90-LS2.8-BR
  rect 1.07x0.6 smd: 1(1.235,-0.95) 2(1.235,0.95) 3(-1.235,0)
SOT-23-6_L2.9-W1.6-P0.95-LS2.8-BR
  rect 1.1x0.6 smd: 1(1.35,-0.95) 2(1.35,0) 3(1.35,0.95) 4(-1.35,0.95) 5(-1.35,0) 6(-1.35,-0.95)
USB-C-SMD_TYPE-606-1.6-T3
  oval 0.8x2 hole 0.6x1.6: 7(5.575,1.2) 10(-5.575,1.2)
  oval 0.8x2.2 hole 0.6x1.8: 8(5.575,-2.6) 9(-5.575,-2.6)
  rect 0.8x1.4 smd: A5(-0.5,2.6) A9(1.52,2.6) A12(2.75,2.6) B5(0.5,2.6) B9(-1.52,2.6) B12(-2.75,2.6)

## Nets
3V3: C3.2 C6.1 C17.1 l1.4 left.3 left.14 LGJQ.6 r1.4 RGJQ.6 right.3 right.14 U2.2
5V: C4.2 D1.1 FUSE1.1 Q1.1 R3.1 R5.1 U56.4
GND: C1.2 C2.1 C3.1 C4.1 C5.2 C6.2 C7.2 C8.2 C15.2 C16.2 C17.2 H7.2 l1.1 left.1 left.2 left.13 left.25 left.42 LGJQ.1 LGL.2 r1.1 R1.1 R2.1 R4.2 R5.2 RGJQ.1 RGL.2 right.1 right.2 right.13 right.25 right.42 U2.1 U56.2 USB3.7 USB3.8 USB3.9 USB3.10 USB3.A12 USB3.B12
VBAT: C1.1 H7.1 Q1.3 U56.3
VDDH: C2.2 C5.1 D1.2 Q1.2 U2.3
C1L: left.28 LJZ.2
C1R: right.16 RJZ.2
C2L: left.27 LGL.5 LJZ.4
C2R: RGL.5 right.17 RJZ.4
C3L: left.24 LJZ.6
C3R: right.19 RJZ.6
C4L: left.23 LJZ.8
C4R: right.20 RJZ.8
C5L: left.22 LJZ.10
C5R: right.21 RJZ.10
C6L: left.21 LJZ.12
C6R: right.22 RJZ.12
C7L: left.20 LJZ.11
C7R: right.23 RJZ.11
CS: RGJQ.5 right.31
CSL: left.29 LGJQ.5
IRQ: RGJQ.2 right.34
IRQL: left.34 LGJQ.2
LGLA: left.17 LGL.1
LGLB: left.16 LGL.3
R1L: left.39 LGL.4 LJZ.1
R1R: RGL.4 right.4 RJZ.1
R2L: left.38 LJZ.3
R2R: right.5 RJZ.3
R3L: left.37 LJZ.5
R3R: right.6 RJZ.5
R4L: left.32 LJZ.7
R4R: right.11 RJZ.7
R5L: left.31 LJZ.9
R5R: right.12 RJZ.9
RGLA: RGL.1 right.27
RGLB: RGL.3 right.28
SCK: RGJQ.3 right.33
SCKL: left.33 LGJQ.3
SCLK: l1.2 left.36
SCLKR: r1.2 right.36
SDIO: RGJQ.4 right.32
SDIOL: left.30 LGJQ.4
SDO: l1.3 left.35
SDOR: r1.3 right.35
XL1: C8.1 left.9 X1.1
XL1R: C16.1 right.9 X2.1
XL2: C7.1 left.10 X1.2
XL2R: C15.1 right.10 X2.2
$1N432: LEDR1.1 U56.1
$1N434: R4.1 U56.6
$1N892: LEDR1.2 R3.2
$1N3578: FUSE1.2 USB3.A9 USB3.B9
$1N3579: R1.2 USB3.A5
$1N3580: R2.2 USB3.B5

Pads without a net: left 4 5 6 7 8 11 12 15 18 19 26 40 41; right 7 8 15 18 24 26 29 30 37 38 39 40 41; U56 5

## Via types
v1: diameter 0.5, hole 0.305, Top Layer to Bottom Layer, 22 vias

## Routing (per net, layer and track width the routed paths; a pad name or vN(x,y) marks a point on that pad's centre or on a via; arc(x,y) is an arc through that point)
3V3: length 214.4
  Top Layer w0.381: RGJQ.6 50.55,14.35 33.86,14.35 28.91,19.3 26.29,19.3 25.59,18.6 25.59,17.78 24.79,16.98 24.79,13.11 23.62,11.94 23.62,6.98 24.38,6.22 26.26,6.22 left.3 ; right.3 65.5,6.25 63.12,8.64 63.12,9.27 66.19,12.34 right.14 66.19,17.17 66.61,17.58 C17.1
  Top Layer w0.508: 41.34,33.53 41.34,36.32 41.47,36.32 ; 41.34,33.53 25.15,33.53 ; 41.34,33.53 41.34,27.75 51.56,17.53 51.56,15.62 RGJQ.6 ; 41.47,36.32 62.87,36.32 ; 41.47,36.32 41.59,36.45 U2.2 ; 62.87,36.32 62.87,45.34 r1.4 ; 62.87,36.32 67.69,31.5 67.69,22.86 66.61,21.78 C17.1 ; LGJQ.6 19.43,25.91 19.43,27.81 25.15,33.53 ; 25.15,33.53 16.13,42.55 l1.4
5V: length 22.7
  Top Layer w0.508: C4.2 46.61,48.83 FUSE1.1 ; C4.2 48.01,47.88 R5.1 49.97,45.93 D1.1 51.45,45.93 53.66,43.72 ; C4.2 45.66,45.55 45,44.89 42.02,47.88 R3.1
GND: length 117.4
  Top Layer w0.381: 41.12,5.56 C8.2 34.25,2.05 left.2 left.1 16.29,1.35 ; 41.12,5.56 42.55,6.98 42.55,9.91 40.26,12.19 37.78,12.19 37.59,12 ; 41.12,5.56 48.92,5.56 RGJQ.1 54.96,2.79 56.4,1.35 right.42 right.1 right.2 ; left.13 26.99,15.85 v1(26.99,16.39) C6.2 ; v1(46.86,46.23) 46.36,45.72 46.36,43.33 ; v1(15.75,15.11) 16.51,14.35 left.25 ; 46.36,43.33 46.36,41.65 R4.2 ; 46.36,43.33 46.96,43.94 U56.2 ; R5.2 49.65,51.83 R1.1 ; 48.34,55.95 50.37,55.95 51.17,56.75 USB3.10 ; 66.89,14.35 66.89,15.88 68.01,16.99 C17.2 73.85,19.56 C15.2 ; USB3.7 40.02,56.75 40.82,55.95 42.84,55.95 41.34,54.44 R2.1 ; right.25 58.49,16.06 v1(56.26,18.29)
  vias: v1(43.31,48.9) v1(50.67,49.28)
VBAT: length 26.3
  Top Layer w0.508: U56.3 51.63,44.89 52.32,44.2 52.32,43.31 53.47,42.16 54.23,42.16 54.74,42.67 54.74,46.07 Q1.3 52.58,48.23 52.58,52.33 53.91,53.66 C1.1 58.23,53.66 H7.1
VDDH: length 25.5
  Top Layer w0.508: D1.2 51.18,42.94 53.35,40.77 ; C2.2 40.7,41.56 U2.3 41.82,41.49 44.45,38.86 51.45,38.86 53.35,40.77 ; 55.56,43.72 55.56,40.89 C5.1 53.35,40.77
C1L: length 26.1
  Top Layer w0.381: LJZ.2 23.37,27.56 23.37,25.4 13.08,15.11 13.08,12.32 14.25,11.15 16.29,11.15
C1R: length 13.3
  Top Layer w0.381: right.16 64.79,25.55 66.29,27.05
C2L: length 53.3
  Top Layer w0.381: LGL.5 40.39,22.23 40.39,30.61 39.5,31.5 29.84,31.5 LJZ.4 26.67,28.32 26.67,25.91 26.03,25.27 24.13,25.27 13.84,14.99 13.84,12.45 14.44,11.85 16.29,11.85
C2R: length 44
  Top Layer w0.381: right.17 64.09,26.71 62.48,28.32 v1(62.48,34.29)
  Bottom Layer w0.381: RGL.5 83.31,29.97 78.99,34.29 v1(62.48,34.29)
C3L: length 22.6
  Top Layer w0.381: LJZ.6 29.21,28.32 29.21,25.91 27.94,24.64 24.38,24.64 17.79,18.04 17.79,14.35
C3R: length 13.3
  Top Layer w0.381: right.19 62.69,25.57 61.21,27.05
C4L: length 24.1
  Top Layer w0.381: LJZ.8 31.75,28.32 31.75,26.04 29.59,23.88 24.77,23.88 18.49,17.6 18.49,14.35
C4R: length 14.1
  Top Layer w0.381: right.20 61.99,23.73 58.67,27.05
C5L: length 26
  Top Layer w0.381: 19.19,14.35 19.19,17.54 25.02,23.37 31.75,23.37 34.29,25.91 34.29,28.32 LJZ.10
C5R: length 14.8
  Top Layer w0.381: right.21 61.29,21.89 56.13,27.05
C6L: length 28.5
  Top Layer w0.381: LJZ.12 37.59,29.59 36.83,28.83 36.83,25.27 34.27,22.71 25.04,22.71 19.89,17.56 left.21
C6R: length 15.9
  Top Layer w0.381: right.22 60.59,20.56 54.1,27.05 53.59,27.05
C7L: length 26.1
  Top Layer w0.381: left.20 20.59,17.57 25.13,22.11 35.7,22.11 38.1,24.51 38.1,27.05
C7R: length 21.7
  Top Layer w0.381: 59.89,14.35 59.89,19.48 54.48,24.89 53.21,24.89 51.31,26.8 51.31,29.21 51.82,29.72 53.47,29.72 RJZ.11
CS: length 7.6
  Top Layer w0.381: right.31 56.1,9.05 52.2,12.95 RGJQ.5
CSL: length 19.9
  Top Layer w0.381: 16.29,10.45 14.27,10.45 12.6,12.12 12.6,15.31 17.02,19.73 LGJQ.5
IRQ: length 6.7
  Top Layer w0.381: RGJQ.2 53.31,6.95 right.34
IRQL: length 22.7
  Top Layer w0.381: 16.29,6.95 14.64,6.95 9.4,12.19 LGJQ.2
LGLA: length 17.2
  Top Layer w0.381: 22.69,14.35 22.69,18.88 25.12,21.31 31.14,21.31 LGL.1
LGLB: length 23.2
  Top Layer w0.381: left.16 23.39,18.69 25.53,20.83 28.07,20.83 32,16.89 36.96,16.89 38.48,18.42 LGL.3
R1L: length 62
  Top Layer w0.381: 16.29,3.45 18.39,3.45 v1(18.42,3.43)
  Bottom Layer w0.381: v1(18.42,3.43) 18.42,4.83 25.4,11.81 25.4,27.05 23.75,28.7 23.75,30.99 24.13,31.37 39.24,31.37 41.02,29.59 LGL.4
R1R: length 42.2
  Top Layer w0.381: right.4 65.95,6.95 v1(65.91,6.98) ; RGL.4 80.65,29.08 80.65,27.05 76.66,23.06 v1(69.34,23.06)
  Bottom Layer w0.381: RJZ.1 69.34,26.54 v1(69.34,23.06) 69.34,10.41 v1(65.91,6.98)
R2L: length 29.3
  Top Layer w0.381: 16.29,4.15 v1(19.05,4.15)
  Bottom Layer w0.381: v1(19.05,4.15) 19.05,4.78 27.94,13.67 27.94,27.05
R2R: length 25.1
  Top Layer w0.381: v1(65.02,7.75) 65.12,7.65 right.5
  Bottom Layer w0.381: RJZ.3 65.02,28.32 v1(65.02,7.75)
R3L: length 30.3
  Top Layer w0.381: v1(19.94,4.83) 19.91,4.85 16.29,4.85
  Bottom Layer w0.381: 30.48,27.05 28.42,24.99 28.42,13.31 v1(19.94,4.83)
R3R: length 25.5
  Top Layer w0.381: right.6 64.93,8.35 v1(64.26,9.02)
  Bottom Layer w0.381: RJZ.5 62.48,28.32 62.48,10.8 v1(64.26,9.02)
R4L: length 42.5
  Top Layer w0.381: 16.29,8.35 v1(18.8,8.35)
  Bottom Layer w0.381: 33.02,27.05 28.91,22.94 28.91,12.01 19.05,2.16 17.53,2.16 16.26,3.43 16.26,5.81 v1(18.8,8.35)
R4R: length 32.8
  Top Layer w0.381: v1(70.23,12.45) 69.64,11.85 right.11
  Bottom Layer w0.381: v1(70.23,12.45) 70.23,28.53 66.88,31.88 60.96,31.88 RJZ.7
R5L: length 49.8
  Top Layer w0.381: 16.29,9.05 v1(19.56,9.05)
  Bottom Layer w0.381: 35.56,27.05 29.84,21.34 29.84,11.3 19.81,1.27 17.15,1.27 14.99,3.43 14.99,6.22 17.78,9.02 19.52,9.02 v1(19.56,9.05)
R5R: length 36.2
  Top Layer w0.381: right.12 69.07,12.55 70.36,13.84 70.36,16.26 v1(71.25,17.15)
  Bottom Layer w0.381: v1(71.25,17.15) 71.12,17.27 71.12,28.32 66.68,32.77 59.31,32.77 RJZ.9
RGLA: length 54.9
  Top Layer w0.381: right.27 59.6,11.85 v1(59.82,12.07)
  Bottom Layer w0.381: v1(59.82,12.07) 61.98,9.91 61.98,8.38 65.15,5.21 78.11,5.21 83.69,10.8 83.69,13.84 73.15,24.38 RGL.1
RGLB: length 54.9
  Top Layer w0.381: right.28 59.33,11.15 v1(59.94,10.54)
  Bottom Layer w0.381: RGL.3 78.23,20.57 84.2,14.61 84.2,9.91 78.74,4.44 63.37,4.44 59.94,7.87 v1(59.94,10.54)
SCK: length 6.1
  Top Layer w0.381: right.33 51.91,7.65 RGJQ.3
SCKL: length 21.1
  Top Layer w0.381: LGJQ.3 11.56,25.4 11.56,11.05 14.99,7.62 16.26,7.62 16.29,7.65
SCLK: length 65.3
  Top Layer w0.381: l1.2 11.05,38.48 2.54,29.97 2.54,14.99 11.98,5.55 16.29,5.55
SCLKR: length 93.3
  Top Layer w0.381: r1.2 74.04,61.59 76.96,61.59 85.85,52.71 85.85,10.29 79.76,4.19 60.71,4.19 59.35,5.55 57.69,5.55
SDIO: length 6.9
  Top Layer w0.381: RGJQ.4 53.75,8.35 right.32
SDIOL: length 19.9
  Top Layer w0.381: LGJQ.4 14.48,17.88 12.12,15.51 12.12,11.92 14.28,9.75 16.29,9.75
SDO: length 64
  Top Layer w0.381: 16.29,6.25 12.8,6.25 3.94,15.11 3.94,29.84 13.59,39.5 l1.3
SDOR: length 88.4
  Top Layer w0.381: r1.3 73.66,59.31 74.93,60.58 77.3,60.58 85.09,52.78 85.09,10.54 79.38,4.83 60.83,4.83 59.41,6.25 right.35
XL1: length 15.5
  Top Layer w0.381: X1.1 39.46,6.96 C8.1 37.65,6.86 34.04,6.86 30.44,10.45 left.9
XL1R: length 13.2
  Top Layer w0.381: X2.1 80.44,10.48 78.23,10.48 78.2,10.45 right.9
XL2: length 14.3
  Top Layer w0.381: left.10 33.3,11.15 34.04,10.41 37.4,10.41 C7.1 39.42,10.6 X1.2
XL2R: length 14.5
  Top Layer w0.381: right.10 72.42,11.15 75.22,13.96 78.05,13.96 C15.1 80.18,13.91 X2.2
$1N432: length 27.9
  Top Layer w0.508: LEDR1.1 36.45,51.48 36.45,48.01 39.37,45.09 42.42,45.09 43.81,43.69 43.81,40.77 45.11,39.47 48.51,39.47 49.4,40.36 49.4,42.16 48.58,42.99 U56.1
$1N434: length 2.5
  Top Layer w0.508: R4.1 45,41.49 45,42.99
$1N892: length 4.4
  Top Layer w0.508: LEDR1.2 37.85,50.3 R3.2
$1N3578: length 6.4
  Top Layer w0.762: v1(44.07,55.95) 44.07,52.96 FUSE1.2
  Bottom Layer w1.016: v1(44.07,55.95) v1(47.11,55.95)
$1N3579: length 5.3
  Top Layer w0.381: R1.2 48.76,54.23 46.36,54.23 46.09,54.49 46.09,55.95
$1N3580: length 9.7
  Top Layer w0.381: 45.09,55.95 45.09,55.06 45.47,54.68 45.47,51.18 45.09,50.8 43.05,50.8 41.79,52.06 R2.2

## Copper pours and planes (outline as drawn; the poured copper is in the pictures)
GND on Top Layer: -10.29,71.88 95.89,71.88 95.89,-11.81 -10.29,-11.81
GND on Bottom Layer: -16.64,82.3 100.71,82.3 100.71,-18.03 -16.64,-18.03

Small or netless copper shapes (teardrops, artwork), in the pictures only: 168 on Top Layer, 15 on Bottom Layer

## Text on the board
Top Silkscreen Layer: LDO | 3407 | 4057 | R | GND | IRQ | SC | SCK | SW | SDIO | VCC | CS | C1 | R1 | C2 | R2 | R3 | C3 | XL1 | XL2 | C4 | R4 | A | C5 | R5 | C6 | C7 | B | LEFT | RIGHT
